# Altium schematic sheet POWER.SchDoc
size Tabloid; SheetNumber: 17; SheetTotal: 23; Sheet_Name: POWER; Size: 11x17
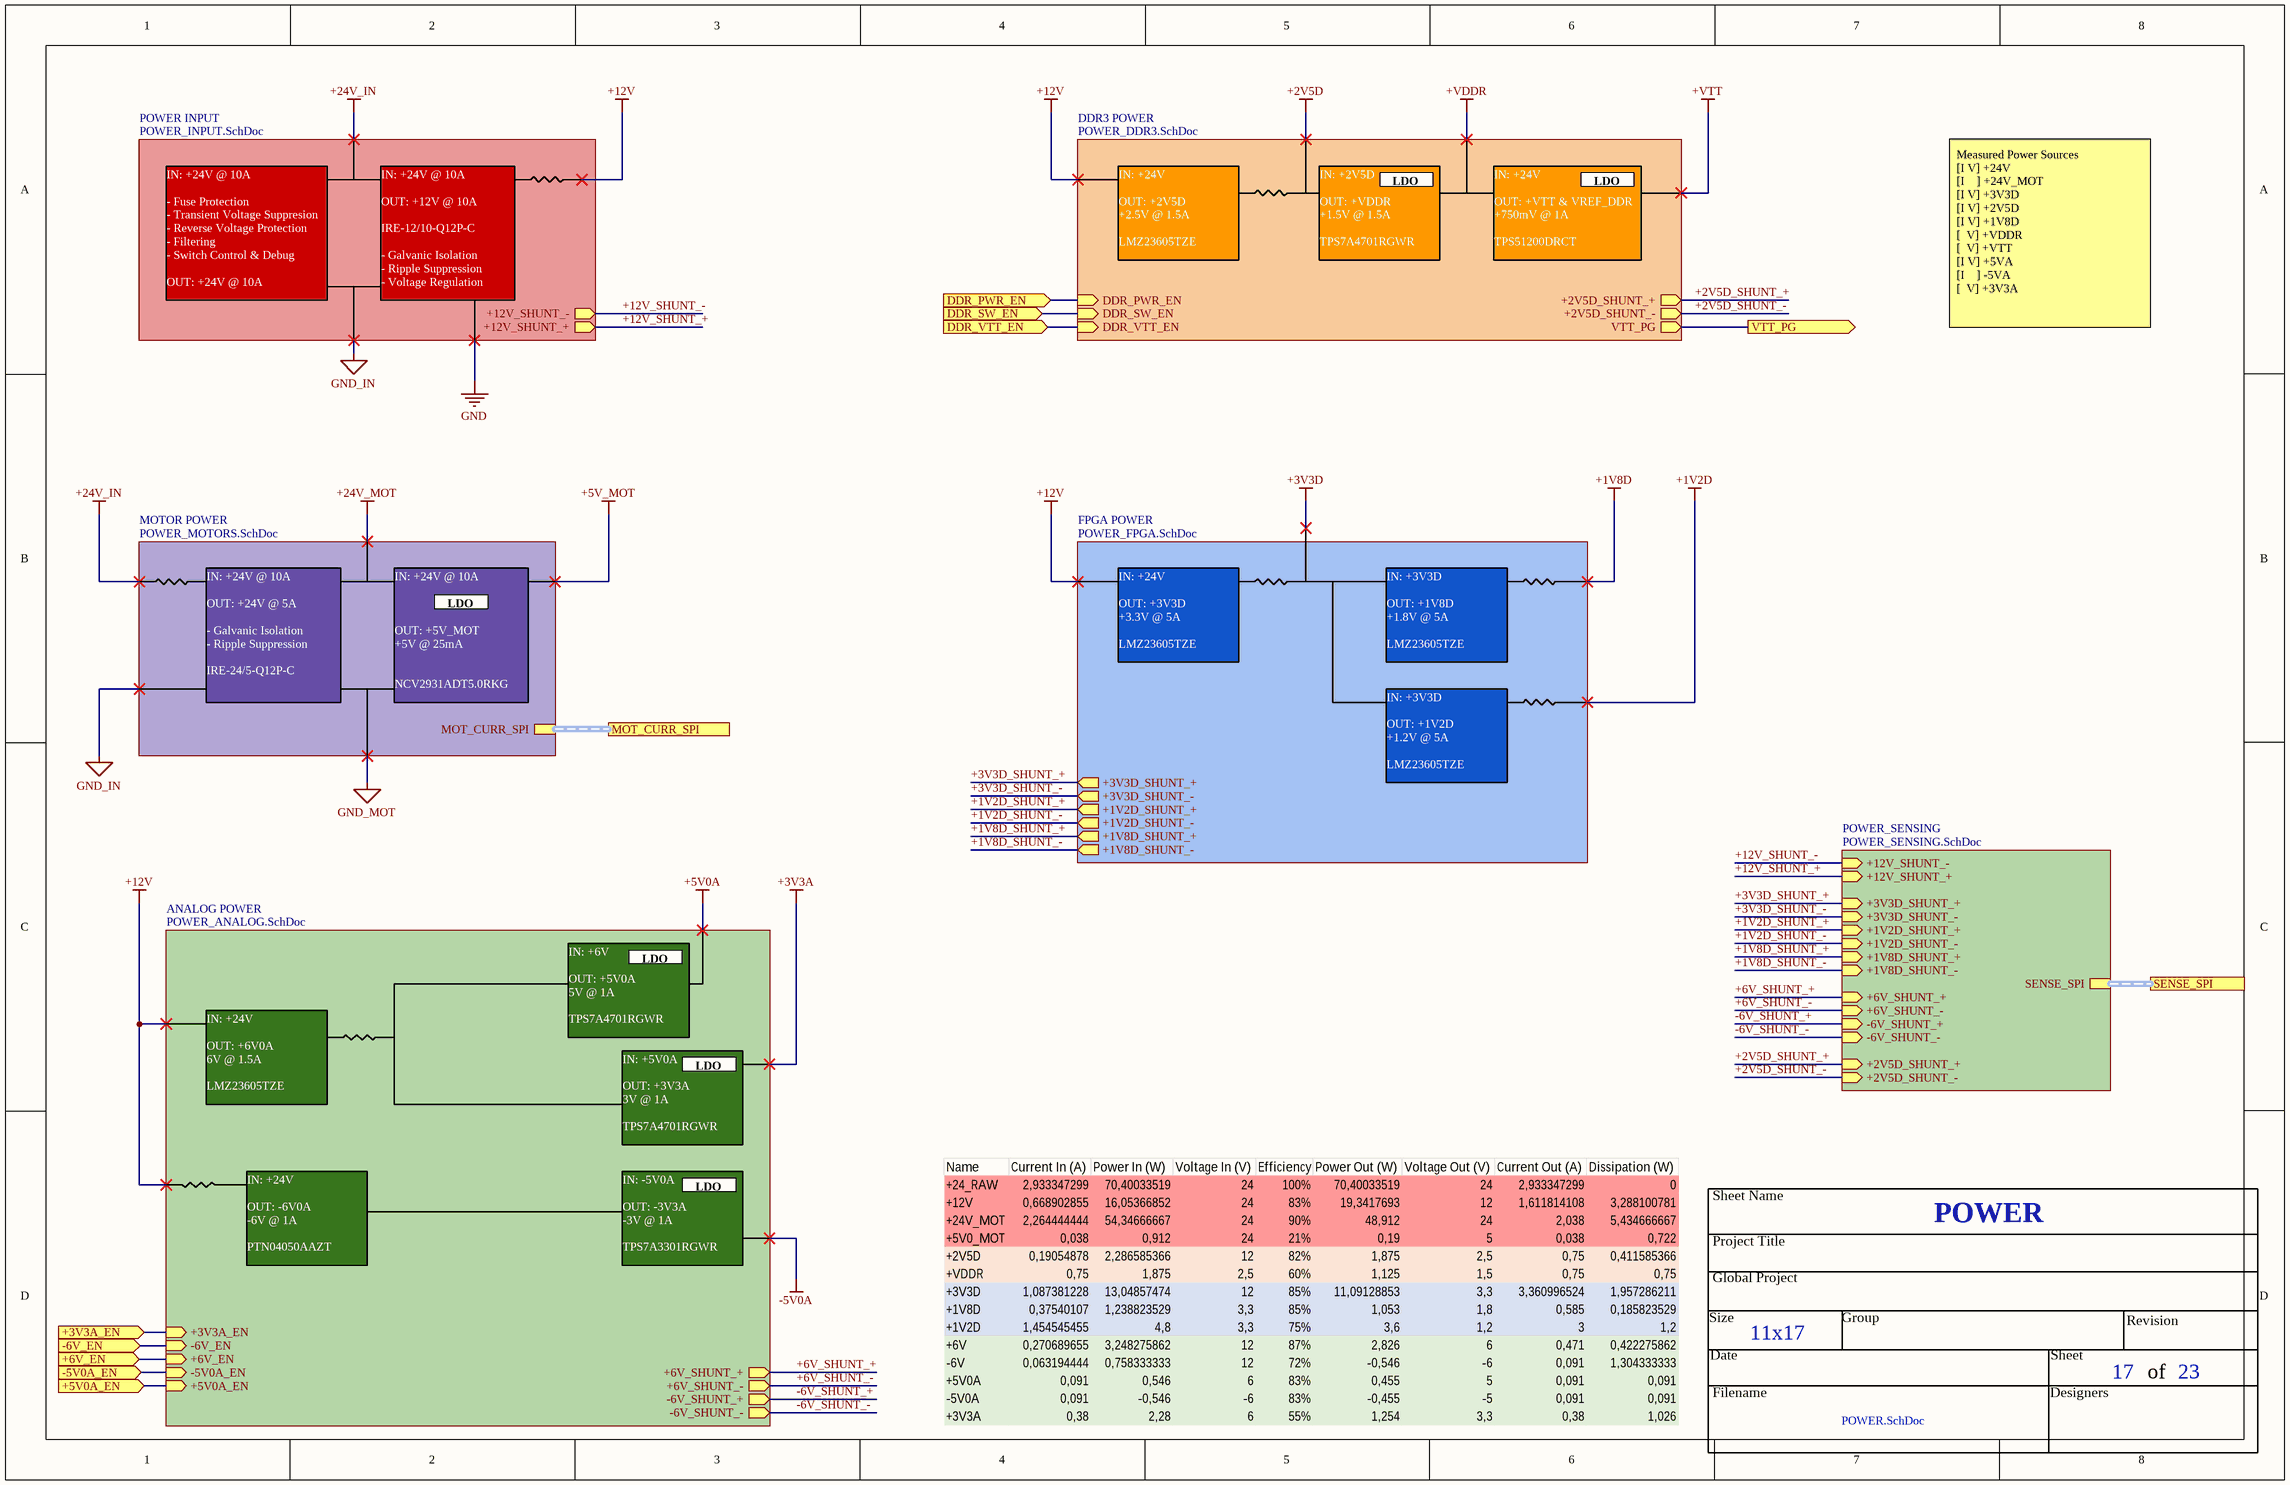
[diagram p0: POWER.SchDoc]

## Sub-sheets
ANALOG POWER = POWER_ANALOG.SchDoc: -6V_EN (in), +3V3A_EN (in), +5V0A_EN (in), -5V0A_EN (in), +6V_EN (in), +6V_SHUNT_+ (out), +6V_SHUNT_- (out), -6V_SHUNT_+ (out), -6V_SHUNT_- (out)
DDR3 POWER = POWER_DDR3.SchDoc: VTT_PG (out), DDR_PWR_EN (in), DDR_SW_EN (in), DDR_VTT_EN (in), +2V5D_SHUNT_+ (out), +2V5D_SHUNT_- (out)
FPGA POWER = POWER_FPGA.SchDoc: +3V3D_SHUNT_+ (out), +3V3D_SHUNT_- (out), +1V2D_SHUNT_+ (out), +1V2D_SHUNT_- (out), +1V8D_SHUNT_+ (out), +1V8D_SHUNT_- (out)
MOTOR POWER = POWER_MOTORS.SchDoc: MOT_CURR_SPI (harness MOT_CURR_SPI)
POWER INPUT = POWER_INPUT.SchDoc: +12V_SHUNT_+ (out), +12V_SHUNT_- (out)
POWER_SENSING = POWER_SENSING.SchDoc: SENSE_SPI (harness SENSE_SPI), +1V8D_SHUNT_- (in), +1V8D_SHUNT_+ (in), +1V2D_SHUNT_- (in), +1V2D_SHUNT_+ (in), +3V3D_SHUNT_- (in), +3V3D_SHUNT_+ (in), +6V_SHUNT_+ (in), +6V_SHUNT_- (in), -6V_SHUNT_+ (in), -6V_SHUNT_- (in), +12V_SHUNT_- (in), +12V_SHUNT_+ (in), +2V5D_SHUNT_+ (in), +2V5D_SHUNT_- (in)

## Ports
+3V3A_EN (in), +5V0A_EN (in), +6V_EN (in), -5V0A_EN (in), -6V_EN (in), DDR_PWR_EN (in), DDR_SW_EN (in), DDR_VTT_EN (in), MOT_CURR_SPI (harness MOT_CURR_SPI), SENSE_SPI (harness SENSE_SPI), VTT_PG (out)

## Nets
+1V2D_SHUNT_+: sheet FPGA POWER/+1V2D_SHUNT_+, sheet POWER_SENSING/+1V2D_SHUNT_+
+1V2D_SHUNT_-: sheet FPGA POWER/+1V2D_SHUNT_-, sheet POWER_SENSING/+1V2D_SHUNT_-
+1V8D_SHUNT_+: sheet FPGA POWER/+1V8D_SHUNT_+, sheet POWER_SENSING/+1V8D_SHUNT_+
+1V8D_SHUNT_-: sheet FPGA POWER/+1V8D_SHUNT_-, sheet POWER_SENSING/+1V8D_SHUNT_-
+2V5D_SHUNT_+: sheet DDR3 POWER/+2V5D_SHUNT_+, sheet POWER_SENSING/+2V5D_SHUNT_+
+2V5D_SHUNT_-: sheet DDR3 POWER/+2V5D_SHUNT_-, sheet POWER_SENSING/+2V5D_SHUNT_-
+3V3A_EN: port +3V3A_EN, sheet ANALOG POWER/+3V3A_EN
+3V3D_SHUNT_+: sheet FPGA POWER/+3V3D_SHUNT_+, sheet POWER_SENSING/+3V3D_SHUNT_+
+3V3D_SHUNT_-: sheet FPGA POWER/+3V3D_SHUNT_-, sheet POWER_SENSING/+3V3D_SHUNT_-
+5V0A_EN: port +5V0A_EN, sheet ANALOG POWER/+5V0A_EN
+6V_EN: port +6V_EN, sheet ANALOG POWER/+6V_EN
+6V_SHUNT_+: sheet ANALOG POWER/+6V_SHUNT_+, sheet POWER_SENSING/+6V_SHUNT_+
+6V_SHUNT_-: sheet ANALOG POWER/+6V_SHUNT_-, sheet POWER_SENSING/+6V_SHUNT_-
+12V_SHUNT_+: sheet POWER INPUT/+12V_SHUNT_+, sheet POWER_SENSING/+12V_SHUNT_+
+12V_SHUNT_-: sheet POWER INPUT/+12V_SHUNT_-, sheet POWER_SENSING/+12V_SHUNT_-
-5V0A_EN: port -5V0A_EN, sheet ANALOG POWER/-5V0A_EN
-6V_EN: port -6V_EN, sheet ANALOG POWER/-6V_EN
-6V_SHUNT_+: sheet ANALOG POWER/-6V_SHUNT_+, sheet POWER_SENSING/-6V_SHUNT_+
-6V_SHUNT_-: sheet ANALOG POWER/-6V_SHUNT_-, sheet POWER_SENSING/-6V_SHUNT_-
DDR_PWR_EN: port DDR_PWR_EN, sheet DDR3 POWER/DDR_PWR_EN
DDR_SW_EN: port DDR_SW_EN, sheet DDR3 POWER/DDR_SW_EN
DDR_VTT_EN: port DDR_VTT_EN, sheet DDR3 POWER/DDR_VTT_EN
VTT_PG: port VTT_PG, sheet DDR3 POWER/VTT_PG

## Buses and harness runs
harness port MOT_CURR_SPI = sheet MOTOR POWER/MOT_CURR_SPI
harness port SENSE_SPI = sheet POWER_SENSING/SENSE_SPI

## Notes on the sheet
- LDO
- IN: +24V @ 10A
  - Fuse Protection
  - Transient Voltage Suppresion
  - Reverse Voltage Protection
  - Filtering
  - Switch Control & Debug
  OUT: +24V @ 10A
- IN: +24V @ 10A
  OUT: +12V @ 10A
  IRE-12/10-Q12P-C
  - Galvanic Isolation
  - Ripple Suppression
  - Voltage Regulation
- IN: +24V
  OUT: +2V5D
  +2.5V @ 1.5A
  LMZ23605TZE
- IN: +2V5D
  OUT: +VDDR
  +1.5V @ 1.5A
  TPS7A4701RGWR
- IN: +24V
  OUT: +VTT & VREF_DDR
  +750mV @ 1A
  TPS51200DRCT
- Measured Power Sources
  [I V] +24V
  [I    ] +24V_MOT
  [I V] +3V3D
  [I V] +2V5D
  [I V] +1V8D
  [  V] +VDDR
  [  V] +VTT
  [I V] +5VA
  [I    ] -5VA
  [  V] +3V3A
- IN: +24V @ 10A
  OUT: +24V @ 5A
  - Galvanic Isolation
  - Ripple Suppression
  IRE-24/5-Q12P-C
- IN: +24V @ 10A
  OUT: +5V_MOT
  +5V @ 25mA
  NCV2931ADT5.0RKG
- IN: +24V
  OUT: +3V3D
  +3.3V @ 5A
  LMZ23605TZE
- IN: +3V3D
  OUT: +1V8D
  +1.8V @ 5A
  LMZ23605TZE
- IN: +3V3D
  OUT: +1V2D
  +1.2V @ 5A
  LMZ23605TZE
- IN: +6V
  OUT: +5V0A
  5V @ 1A
  TPS7A4701RGWR
- IN: +24V
  OUT: +6V0A
  6V @ 1.5A
  LMZ23605TZE
- IN: +5V0A
  OUT: +3V3A
  3V @ 1A
  TPS7A4701RGWR
- IN: +24V
  OUT: -6V0A
  -6V @ 1A
  PTN04050AAZT
- IN: -5V0A
  OUT: -3V3A
  -3V @ 1A
  TPS7A3301RGWR
- Sheet Name
- Project Title
- Global Project
- Revision
- Size
- Date
- Group
- Sheet
- of
- Filename
- Designers